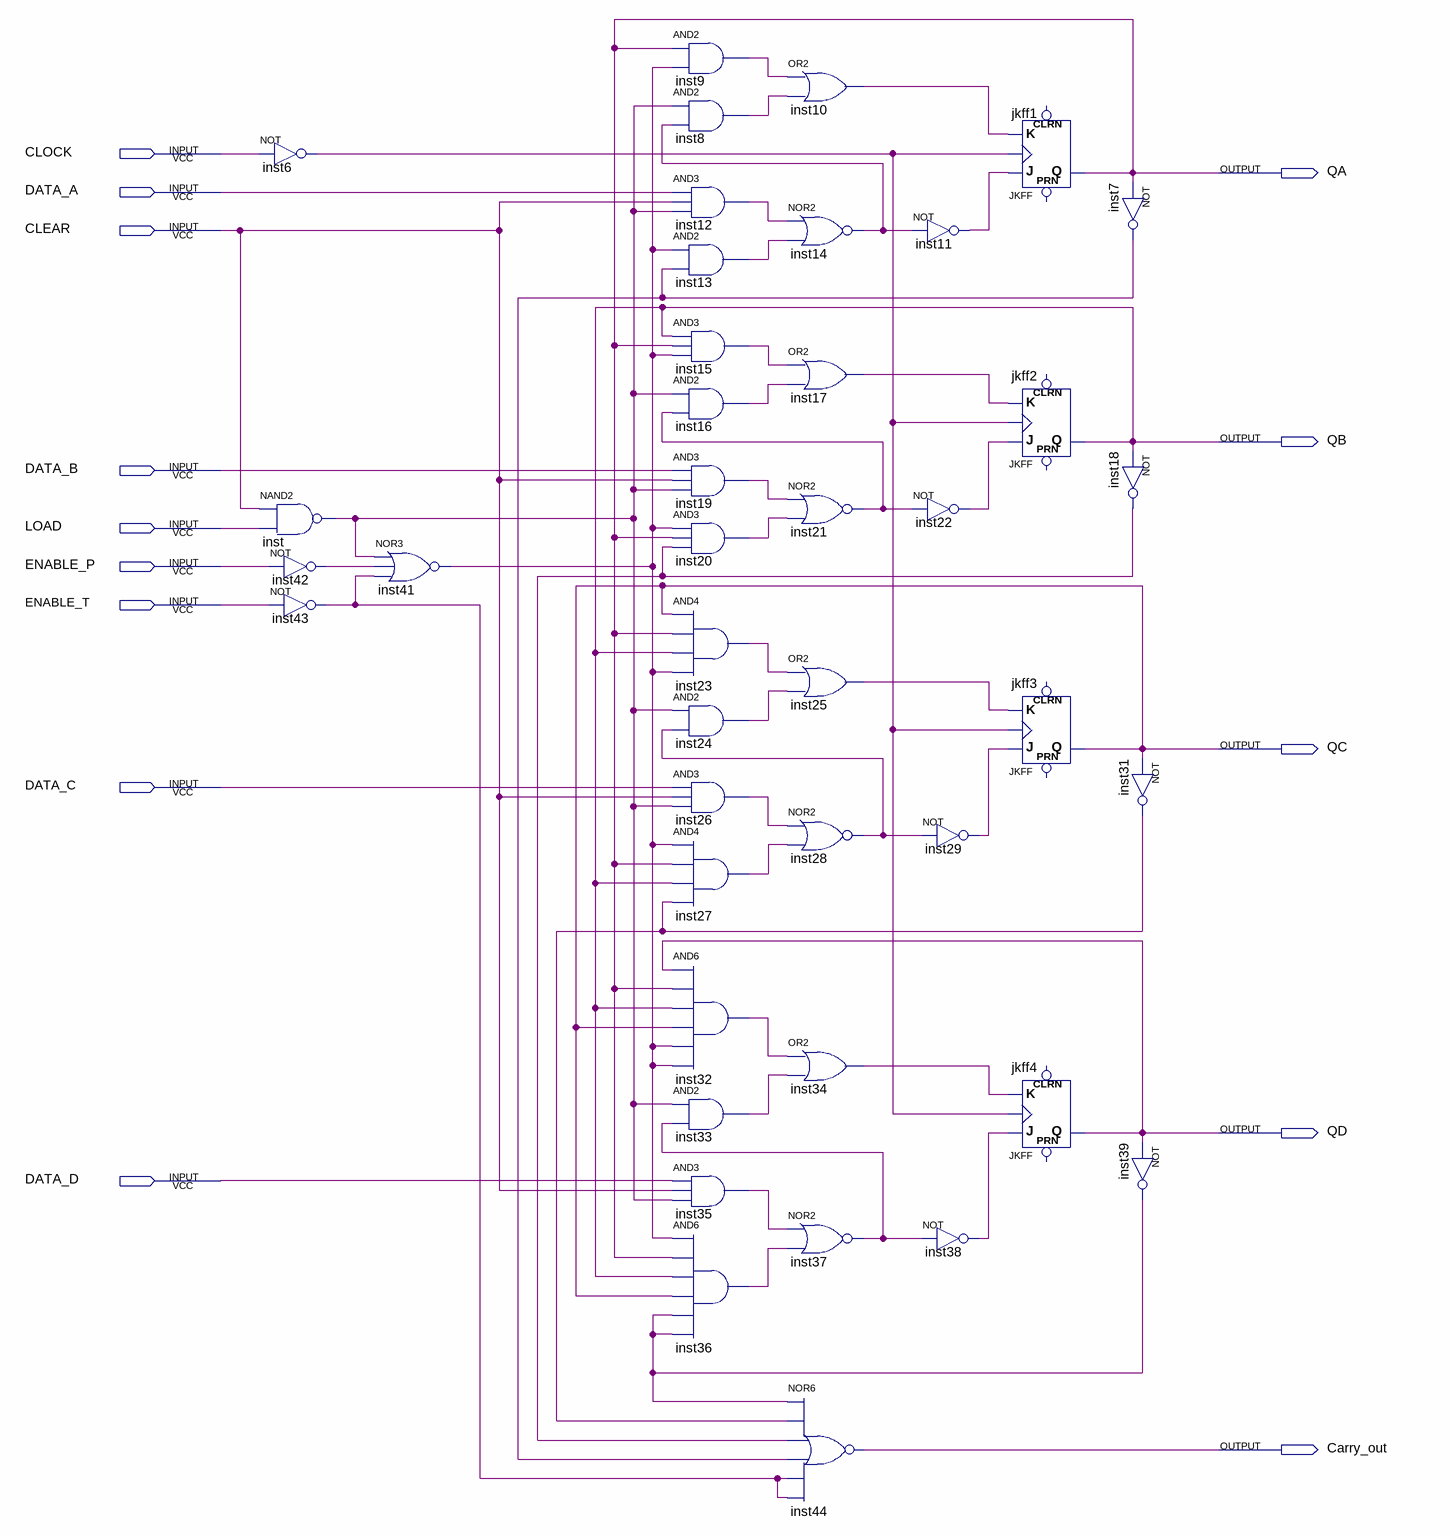
[diagram p0: schematic sheet]
// Quartus schematic CI74LS161.bdf as structural Verilog: 42 symbols, 14 pins
module CI74LS161 (
  input  CLOCK,
  input  DATA_A,
  input  CLEAR,
  input  DATA_B,
  input  LOAD,
  input  ENABLE_P,
  input  ENABLE_T,
  input  DATA_C,
  input  DATA_D,
  output QA,
  output QB,
  output QC,
  output QD,
  output Carry_out
);

  wire inst6_out, inst7_out, inst8_out, inst9_out, inst10_out, inst11_out, inst12_out, inst13_out,
       inst14_out, inst15_out, inst16_out, inst17_out, inst18_out, inst19_out, inst20_out, inst21_out,
       inst22_out, inst23_out, inst24_out, inst25_out, inst26_out, inst27_out, inst28_out, inst29_out,
       inst31_out, inst32_out, inst33_out, inst34_out, inst35_out, inst36_out, inst37_out, inst38_out,
       inst39_out, inst41_out, inst42_out, inst43_out, inst_out;

  not inst6 (inst6_out, CLOCK);
  nand inst (inst_out, CLEAR, LOAD);
  not inst42 (inst42_out, ENABLE_P);
  not inst43 (inst43_out, ENABLE_T);
  nor inst41 (inst41_out, inst_out, inst42_out, inst43_out);
  and inst9 (inst9_out, QA, inst41_out);
  and inst8 (inst8_out, inst_out, inst14_out);
  and inst12 (inst12_out, DATA_A, CLEAR, inst_out);
  and inst13 (inst13_out, inst41_out, inst7_out);
  and inst15 (inst15_out, QB, QA, inst41_out);
  and inst16 (inst16_out, inst_out, inst21_out);
  and inst19 (inst19_out, DATA_B, CLEAR, inst_out);
  and inst20 (inst20_out, inst41_out, QA, inst18_out);
  and inst23 (inst23_out, QC, QA, QB, inst41_out);
  and inst24 (inst24_out, inst_out, inst28_out);
  and inst26 (inst26_out, DATA_C, CLEAR, inst_out);
  and inst27 (inst27_out, inst41_out, QA, QB, inst31_out);
  and inst32 (inst32_out, QD, QA, QB, QC, inst41_out, inst41_out);
  and inst33 (inst33_out, inst_out, inst37_out);
  and inst35 (inst35_out, DATA_D, CLEAR, inst_out);
  and inst36 (inst36_out, inst41_out, QA, QB, QC, inst39_out, inst39_out);
  or inst10 (inst10_out, inst9_out, inst8_out);
  nor inst14 (inst14_out, inst12_out, inst13_out);
  or inst17 (inst17_out, inst15_out, inst16_out);
  nor inst21 (inst21_out, inst19_out, inst20_out);
  or inst25 (inst25_out, inst23_out, inst24_out);
  nor inst28 (inst28_out, inst26_out, inst27_out);
  or inst34 (inst34_out, inst32_out, inst33_out);
  nor inst37 (inst37_out, inst35_out, inst36_out);
  nor inst44 (Carry_out, inst39_out, inst31_out, inst18_out, inst7_out, inst43_out, inst43_out);
  not inst11 (inst11_out, inst14_out);
  not inst22 (inst22_out, inst21_out);
  not inst29 (inst29_out, inst28_out);
  not inst38 (inst38_out, inst37_out);
  JKFF jkff1 (.K(inst10_out), .J(inst11_out), .CLK(inst6_out), .Q(QA));  // open: PRN, CLRN
  JKFF jkff2 (.K(inst17_out), .J(inst22_out), .CLK(inst6_out), .Q(QB));  // open: PRN, CLRN
  JKFF jkff3 (.K(inst25_out), .J(inst29_out), .CLK(inst6_out), .Q(QC));  // open: PRN, CLRN
  JKFF jkff4 (.K(inst34_out), .J(inst38_out), .CLK(inst6_out), .Q(QD));  // open: PRN, CLRN
  not inst7 (inst7_out, QA);
  not inst18 (inst18_out, QB);
  not inst31 (inst31_out, QC);
  not inst39 (inst39_out, QD);
endmodule
